# Altium schematic sheet 04_OSD.SchDoc
size A4
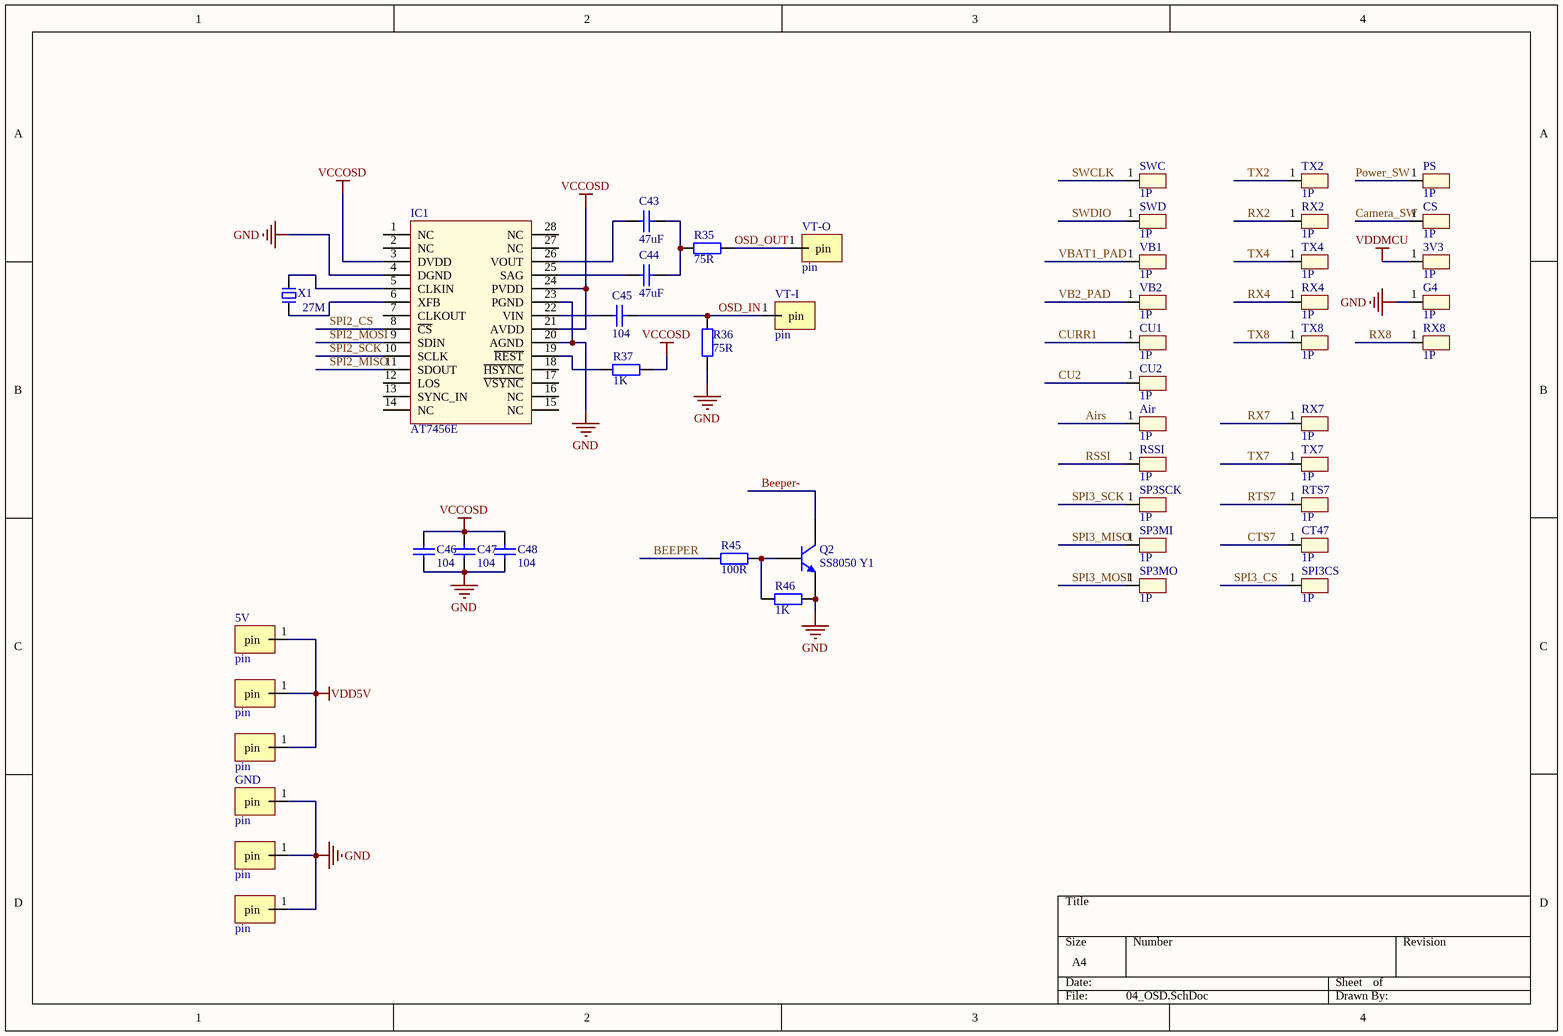
[diagram p0: 04_OSD.SchDoc]

## Parts
3V3  1P  [1P-1.0]
5V  pin  [DIAN_0.5-1.0]
5V1  pin  [DIAN_0.5-1.0]
5V2  pin  [DIAN_0.5-1.0]
Air  1P  [1P-1.0]
C43  47uF  [0805_C]
C44  47uF  [0805_C]
C45  104  [0402_C]
C46  104  [0402_C]
C47  104  [0402_C]
C48  104  [0402_C]
CS  1P  [1P-1.0]
CT47  1P  [1P-1.0]
CU1  1P  [1P-1.0]
CU2  1P  [1P-1.0]
G2  pin  [DIAN_0.5-1.0]
G3  pin  [DIAN_0.5-1.0]
G4  1P  [1P-1.0]
GND  pin  [DIAN_0.5-1.0]
IC1  AT7456E  [TSSOP28_L_E]
PS  1P  [1P-1.0]
Q2  SS8050 Y1  [SOT-23(SOT-23-3)]
R35  75R  [0402_R]
R36  75R  [0402_R]
R37  1K  [0402_R]
R45  100R  [0402_R]
R46  1K  [0402_R]
RSSI  1P  [1P-1.0]
RTS7  1P  [1P-1.0]
RX2  1P  [1P-1.0]
RX4  1P  [1P-1.0]
RX7  1P  [1P-1.0]
RX8  1P  [1P-1.0]
SP3MI  1P  [1P-1.0]
SP3MO  1P  [1P-1.0]
SP3SCK  1P  [1P-1.0]
SPI3CS  1P  [1P-1.0]
SWC  1P  [1P-1.0]
SWD  1P  [1P-1.0]
TX2  1P  [1P-1.0]
TX4  1P  [1P-1.0]
TX7  1P  [1P-1.0]
TX8  1P  [1P-1.0]
VB1  1P  [1P-1.0]
VB2  1P  [1P-1.0]
VT-I  pin  [DIAN_0.5-1.0]
VT-O  pin  [DIAN_0.5-1.0]
X1  27M  [XTAL-3225]

## Nets
GND: C46.2 C47.2 C48.2 G2.1(pin) G3.1(pin) G4.1 GND.1(pin) IC1.4(DGND) IC1.20(AGND) IC1.23(PGND) Q2.2(E) R36.1 R46.2
VCCOSD: C46.1 C47.1 C48.1 IC1.3(DVDD) IC1.21(AVDD) IC1.24(PVDD) R37.2
VDD5V: 5V.1(pin) 5V1.1(pin) 5V2.1(pin)
VDDMCU: 3V3.1
Airs: Air.1
BEEPER: R45.1
Beeper-: Q2.3(C)
Camera_SW: CS.1
CTS7: CT47.1
CU2: CU2.1
CURR1: CU1.1
OSD_IN: C45.2 R36.2 VT-I.1(pin)
OSD_OUT: R35.2 VT-O.1(pin)
Power_SW: PS.1
RSSI: RSSI.1
RTS7: RTS7.1
RX2: RX2.1
RX4: RX4.1
RX7: RX7.1
RX8: RX8.1
SPI2_CS: IC1.8(~{CS})
SPI2_MISO: IC1.11(SDOUT)
SPI2_MOSI: IC1.9(SDIN)
SPI2_SCK: IC1.10(SCLK)
SPI3_CS: SPI3CS.1
SPI3_MISO: SP3MI.1
SPI3_MOSI: SP3MO.1
SPI3_SCK: SP3SCK.1
SWCLK: SWC.1
SWDIO: SWD.1
TX2: TX2.1
TX4: TX4.1
TX7: TX7.1
TX8: TX8.1
VB2_PAD: VB2.1
VBAT1_PAD: VB1.1
NetC43_1: C43.1 IC1.26(VOUT)
NetC43_2: C43.2 C44.2 R35.1
NetC44_1: C44.1 IC1.25(SAG)
NetC45_1: C45.1 IC1.22(VIN)
NetIC1_5: IC1.5(CLKIN) X1.3
NetIC1_6: IC1.6(XFB) X1.1
NetIC1_19: IC1.19(~{REST}) R37.1
NetQ2_1: Q2.1(B) R45.2 R46.1

Not connected (* = marked no-connect by the designer): IC1 1(NC) 2(NC) 7(CLKOUT) 12(LOS) 13(SYNC_IN) 14(NC) 15(NC) 16(NC) 17(~{VSYNC}) 18(~{HSYNC}) 27(NC) 28(NC)

## Library data of the parts
5V 5V1 5V2 G2 G3 GND VT-I VT-O = dian
C43 C44 = 0805 100nF(104) 10% 50V: 贴片电容; ComponentLink1Description: 供应商链接; ComponentLink1URL: http://www.szlcsc.com/product/details_50686.html; Package: 0805; Supplier: LC; SuppliersPartNumber: C49678
C45-C48 = 0402 100nF (104) 10% 16V: 贴片电容; ComponentLink1Description: 供应商链接; ComponentLink1URL: http://www.szlcsc.com/product/details_1877.html; Package: 0402; Supplier: LC; SuppliersPartNumber: C1525
IC1 = AT7456E: OSD芯片
Q2 = SOT-23 SS8050 Y1: 三极管; ComponentLink1Description: 供应商链接; ComponentLink1URL: http://www.szlcsc.com/product/details_2507.html; Package: SOT-23; Supplier: LC; SuppliersPartNumber: C2150
R35-R37 R45 R46 = 0402 100Ω (1000) 1%: 贴片电阻; ComponentLink1Description: 供应商链接; ComponentLink1URL: http://www.szlcsc.com/product/details_25819.html; Package: 0402; Supplier: LC; SuppliersPartNumber: C25076
X1 = XTAL-4P: 4脚无源晶振; BOM名称: 4脚晶振; 版权归属: 源创客; 学习资源: www.ooocke.com